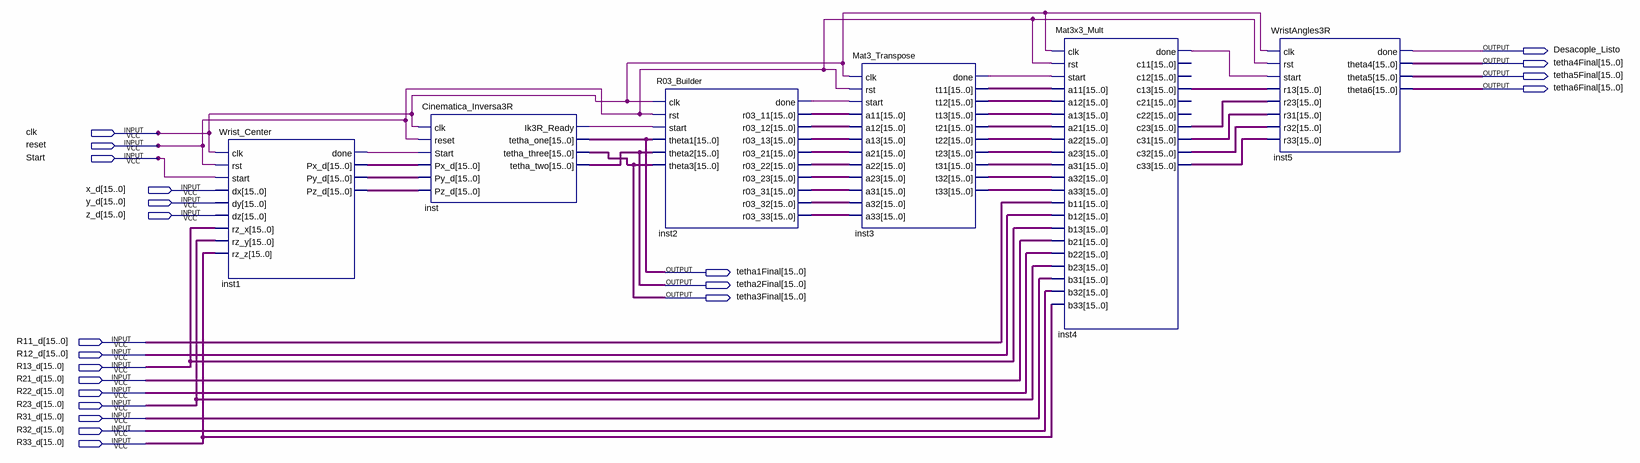
[diagram p0: schematic sheet]
// Quartus schematic Desacople6R_Top.bdf as structural Verilog: 6 symbols, 22 pins
module Desacople6R_Top (
  input  clk,
  input  reset,
  input  Start,
  input  [15:0] x_d,
  input  [15:0] y_d,
  input  [15:0] z_d,
  input  [15:0] R11_d,
  input  [15:0] R12_d,
  input  [15:0] R13_d,
  input  [15:0] R21_d,
  input  [15:0] R22_d,
  input  [15:0] R23_d,
  input  [15:0] R31_d,
  input  [15:0] R32_d,
  input  [15:0] R33_d,
  output Desacople_Listo,
  output [15:0] tetha4Final,
  output [15:0] tetha5Final,
  output [15:0] tetha6Final,
  output [15:0] tetha1Final,
  output [15:0] tetha2Final,
  output [15:0] tetha3Final
);

  wire inst1_done, inst2_done, inst3_done, inst4_done, inst_ik3r_ready;
  wire [15:0] inst1_px_d, inst1_py_d, inst1_pz_d, inst2_r03_11, inst2_r03_12, inst2_r03_13, inst2_r03_21,
       inst2_r03_22, inst2_r03_23, inst2_r03_31, inst2_r03_32, inst2_r03_33, inst3_t11, inst3_t12, inst3_t13,
       inst3_t21, inst3_t22, inst3_t23, inst3_t31, inst3_t32, inst3_t33, inst4_c13, inst4_c23, inst4_c31,
       inst4_c32, inst4_c33;

  Wrist_Center inst1 (
    .clk(clk), .rst(reset), .start(Start), .dx(x_d), .dy(y_d), .dz(z_d), .rz_x(R13_d), .rz_y(R23_d),
    .rz_z(R33_d), .done(inst1_done), .Px_d(inst1_px_d), .Py_d(inst1_py_d), .Pz_d(inst1_pz_d));
  Cinematica_Inversa3R inst (
    .clk(clk), .reset(reset), .Start(inst1_done), .Px_d(inst1_px_d), .Py_d(inst1_py_d), .Pz_d(inst1_pz_d),
    .Ik3R_Ready(inst_ik3r_ready), .tetha_one(tetha1Final), .tetha_three(tetha3Final), .tetha_two(tetha2Final));
  R03_Builder inst2 (
    .clk(clk), .rst(reset), .start(inst_ik3r_ready), .theta1(tetha1Final), .theta2(tetha2Final),
    .theta3(tetha3Final), .done(inst2_done), .r03_11(inst2_r03_11), .r03_12(inst2_r03_12),
    .r03_13(inst2_r03_13), .r03_21(inst2_r03_21), .r03_22(inst2_r03_22), .r03_23(inst2_r03_23),
    .r03_31(inst2_r03_31), .r03_32(inst2_r03_32), .r03_33(inst2_r03_33));
  Mat3_Transpose inst3 (
    .clk(clk), .rst(reset), .start(inst2_done), .a11(inst2_r03_11), .a12(inst2_r03_12), .a13(inst2_r03_13),
    .a21(inst2_r03_21), .a22(inst2_r03_22), .a23(inst2_r03_23), .a31(inst2_r03_31), .a32(inst2_r03_32),
    .a33(inst2_r03_33), .done(inst3_done), .t11(inst3_t11), .t12(inst3_t12), .t13(inst3_t13),
    .t21(inst3_t21), .t22(inst3_t22), .t23(inst3_t23), .t31(inst3_t31), .t32(inst3_t32), .t33(inst3_t33));
  Mat3x3_Mult inst4 (
    .clk(clk), .rst(reset), .start(inst3_done), .a11(inst3_t11), .a12(inst3_t12), .a13(inst3_t13),
    .a21(inst3_t21), .a22(inst3_t22), .a23(inst3_t23), .a31(inst3_t31), .a32(inst3_t32), .a33(inst3_t33),
    .b11(R11_d), .b12(R12_d), .b13(R13_d), .b21(R21_d), .b22(R22_d), .b23(R23_d), .b31(R31_d), .b32(R32_d),
    .b33(R33_d), .done(inst4_done), .c13(inst4_c13), .c23(inst4_c23), .c31(inst4_c31), .c32(inst4_c32),
    .c33(inst4_c33));  // open: c11, c12, c21, c22
  WristAngles3R inst5 (
    .clk(clk), .rst(reset), .start(inst4_done), .r13(inst4_c13), .r23(inst4_c23), .r31(inst4_c31),
    .r32(inst4_c32), .r33(inst4_c33), .done(Desacople_Listo), .theta4(tetha4Final), .theta5(tetha5Final),
    .theta6(tetha6Final));
endmodule
